# EasyEDA Pro project USB_C_BREADBOARD_PD.eprj, schematic Schematic2
Board Name: V2; Create Date: 2025-01-20; Page Name: P1; Project Name: USB_C_BREADBOARD_PD; Schematic Name: Schematic2; Update Date: 2025-02-18; Company: EasyEDA.com; Page Size: A4; Version: V1.0
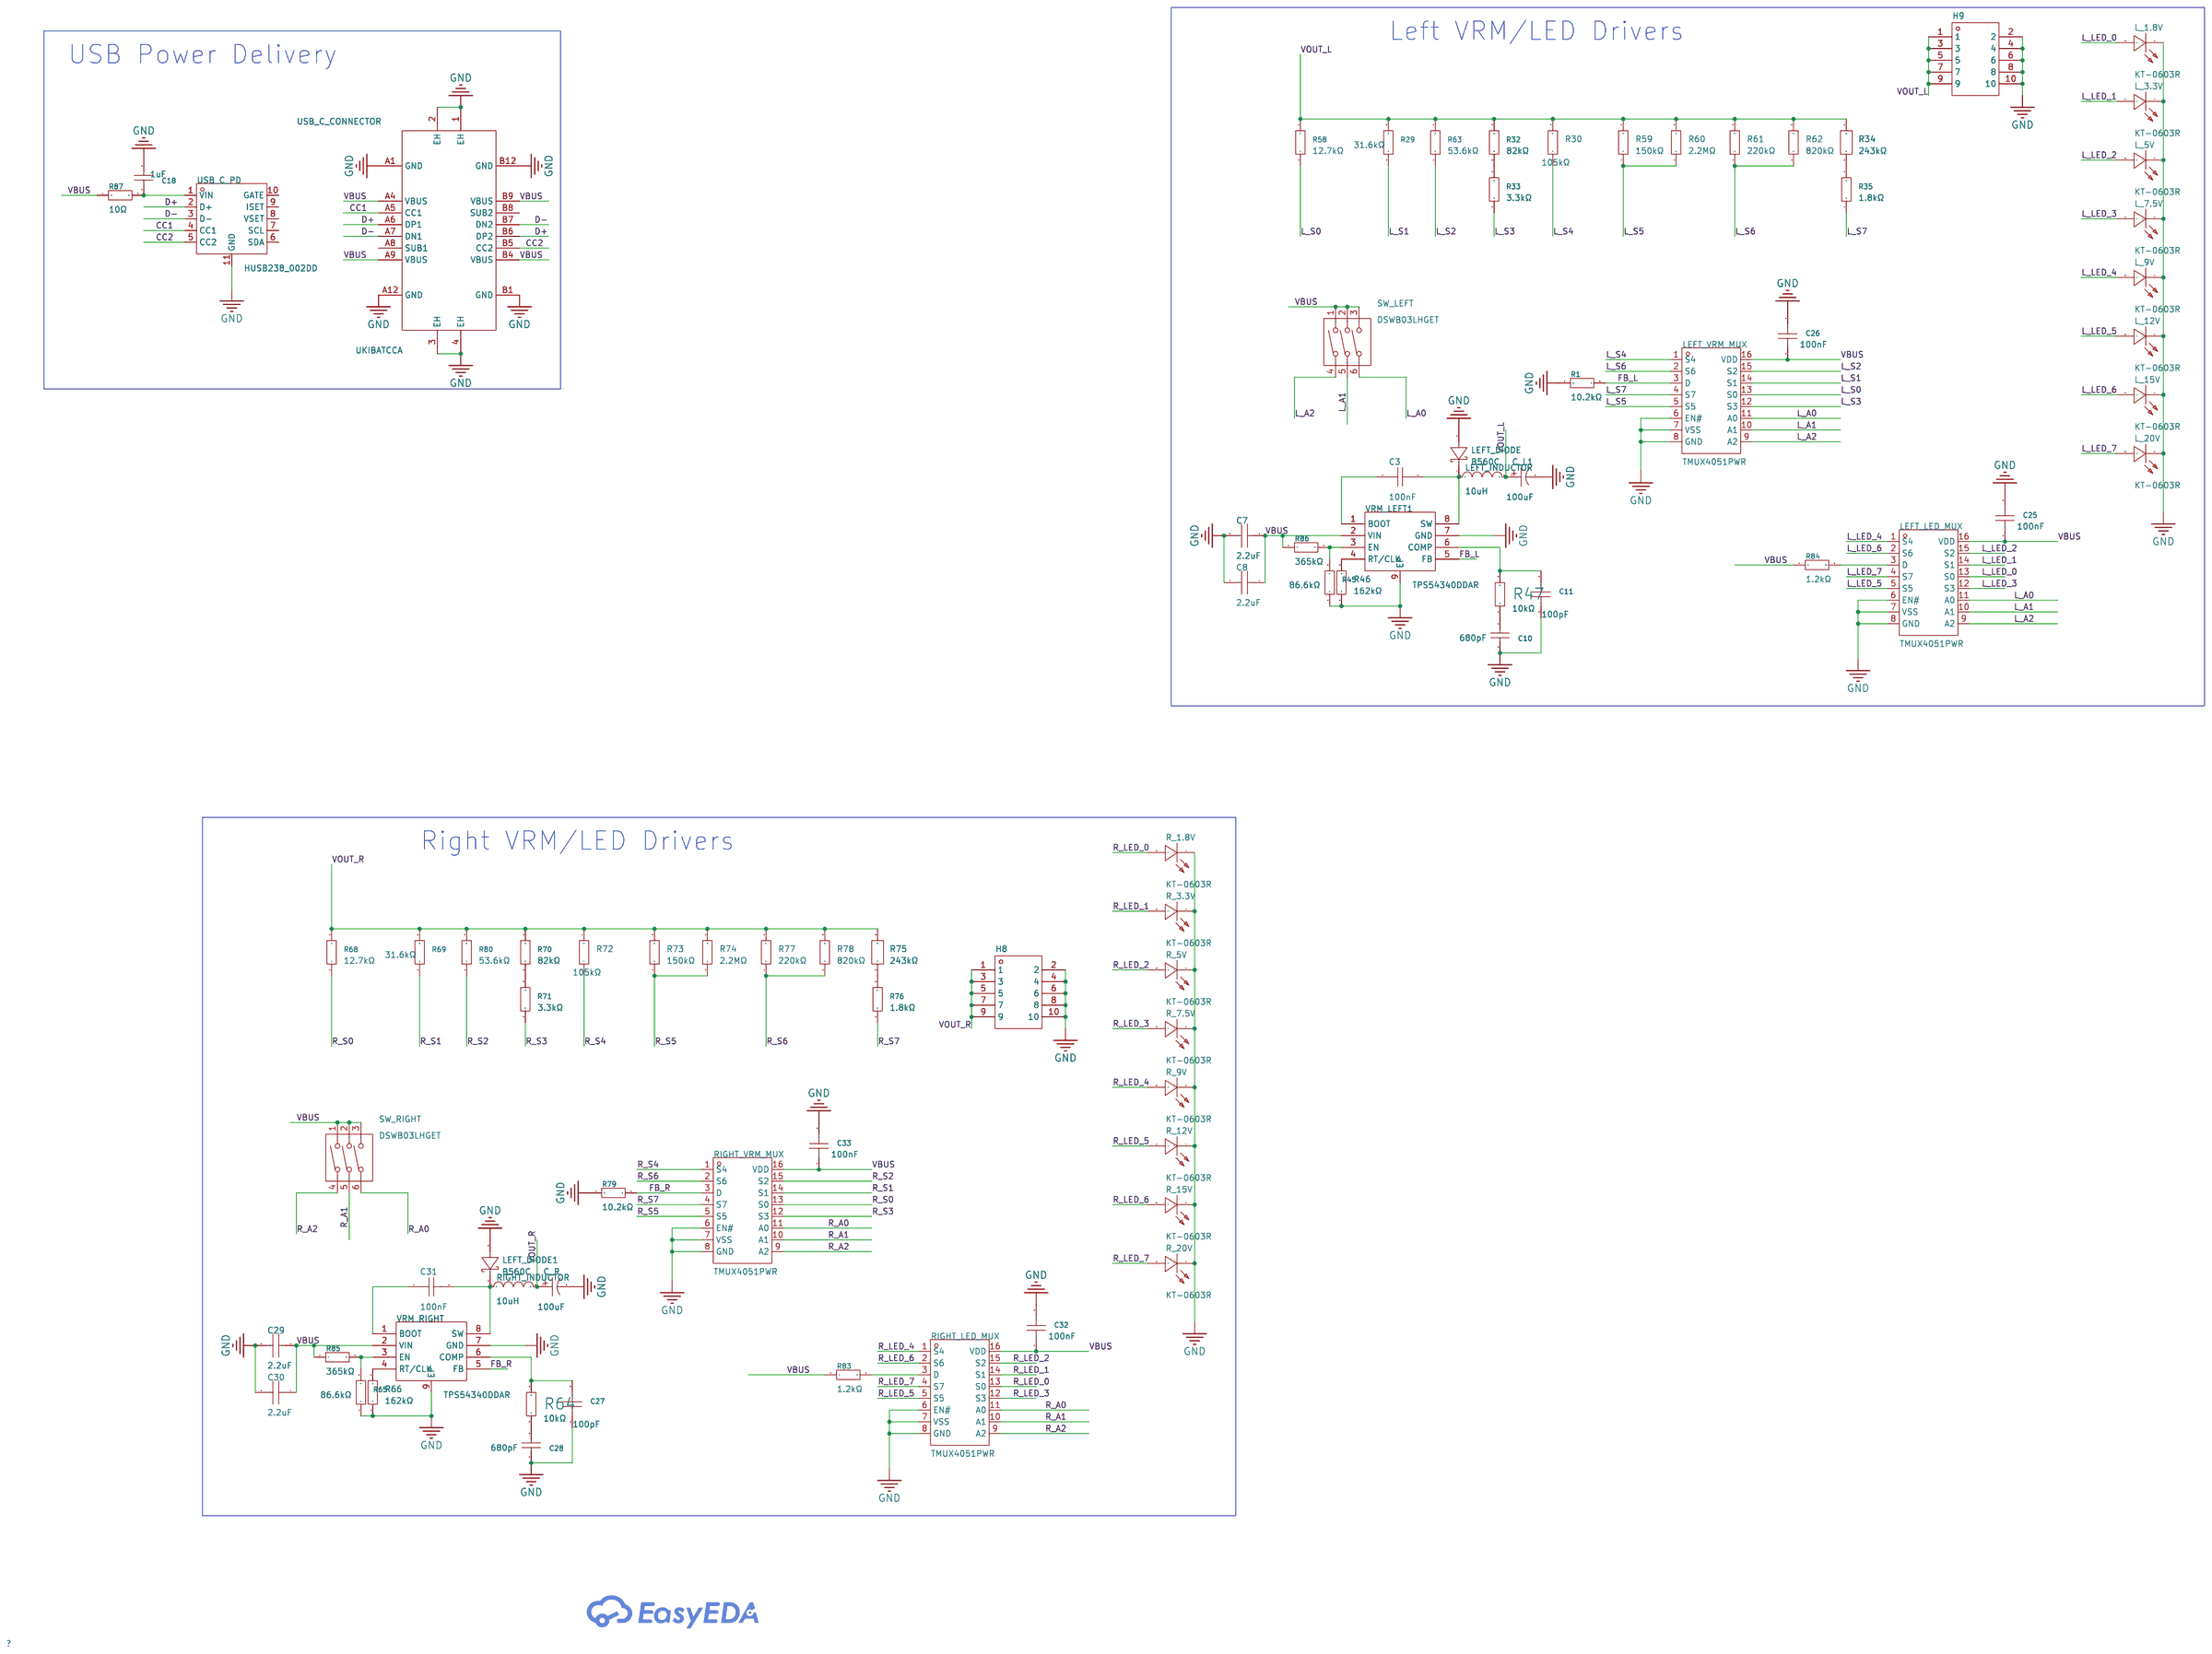
[diagram p1: schematic sheet]

## Parts
C3  100nF  [C0603]
C7  2.2uF  [C0402]
C8  2.2uF  [C0402]
C10  680pF  [C0603]
C11  100pF  [C0603]
C18  1uF  [C0402]
C25  100nF  [C0603]
C26  100nF  [C0603]
C27  100pF  [C0603]
C28  680pF  [C0603]
C29  2.2uF  [C0402]
C30  2.2uF  [C0402]
C31  100nF  [C0603]
C32  100nF  [C0603]
C33  100nF  [C0603]
C_L1  100uF  [CAP-SMD_BD6.3-L6.6-W6.6-LS7.6-FD]
C_R  100uF  [CAP-SMD_BD6.3-L6.6-W6.6-LS7.6-FD]
H8  -  [HDR-TH_10P-P2.54-V-M-R2-C5-S2.54]
H9  -  [HDR-TH_10P-P2.54-V-M-R2-C5-S2.54]
L_1.8V  KT-0603R  [LED0603-RD]
L_3.3V  KT-0603R  [LED0603-RD]
L_5V  KT-0603R  [LED0603-RD]
L_7.5V  KT-0603R  [LED0603-RD]
L_9V  KT-0603R  [LED0603-RD]
L_12V  KT-0603R  [LED0603-RD]
L_15V  KT-0603R  [LED0603-RD]
L_20V  KT-0603R  [LED0603-RD]
LEFT_DIODE  B560C  [SMC_L6.9-W5.9-LS7.9-RD]
LEFT_DIODE1  B560C  [SMC_L6.9-W5.9-LS7.9-RD]
LEFT_INDUCTOR  10uH  [IND-SMD_L7.3-W6.8]
LEFT_LED_MUX  TMUX4051PWR  [TSSOP-16_L5.0-W4.4-P0.65-LS6.4-BL]
LEFT_VRM_MUX  TMUX4051PWR  [TSSOP-16_L5.0-W4.4-P0.65-LS6.4-BL]
R1  10.2kΩ  [R0402]
R29  31.6kΩ  [R0603]
R30  105kΩ  [R0603]
R32  82kΩ  [R0603]
R33  3.3kΩ  [R0603]
R34  243kΩ  [R0603]
R35  1.8kΩ  [R0603]
R45  86.6kΩ  [R0603]
R46  162kΩ  [R0603]
R47  10kΩ  [R0603]
R58  12.7kΩ  [R0402]
R59  150kΩ  [R0402]
R60  2.2MΩ  [R0402]
R61  220kΩ  [R0402]
R62  820kΩ  [R0402]
R63  53.6kΩ  [R0402]
R64  10kΩ  [R0603]
R65  86.6kΩ  [R0603]
R66  162kΩ  [R0603]
R68  12.7kΩ  [R0402]
R69  31.6kΩ  [R0603]
R70  82kΩ  [R0603]
R71  3.3kΩ  [R0603]
R72  105kΩ  [R0603]
R73  150kΩ  [R0402]
R74  2.2MΩ  [R0402]
R75  243kΩ  [R0603]
R76  1.8kΩ  [R0603]
R77  220kΩ  [R0402]
R78  820kΩ  [R0402]
R79  10.2kΩ  [R0402]
R80  53.6kΩ  [R0402]
R83  1.2kΩ  [R0805]
R84  1.2kΩ  [R0805]
R85  365kΩ  [R0402]
R86  365kΩ  [R0402]
R87  10Ω  [R0603]
R_1.8V  KT-0603R  [LED0603-RD]
R_3.3V  KT-0603R  [LED0603-RD]
R_5V  KT-0603R  [LED0603-RD]
R_7.5V  KT-0603R  [LED0603-RD]
R_9V  KT-0603R  [LED0603-RD]
R_12V  KT-0603R  [LED0603-RD]
R_15V  KT-0603R  [LED0603-RD]
R_20V  KT-0603R  [LED0603-RD]
RIGHT_INDUCTOR  10uH  [IND-SMD_L7.3-W6.8]
RIGHT_LED_MUX  TMUX4051PWR  [TSSOP-16_L5.0-W4.4-P0.65-LS6.4-BL]
RIGHT_VRM_MUX  TMUX4051PWR  [TSSOP-16_L5.0-W4.4-P0.65-LS6.4-BL]
SW_LEFT  DSWB03LHGET  [SW-TH_DSWB03LHGET]
SW_RIGHT  DSWB03LHGET  [SW-TH_DSWB03LHGET]
USB_C_CONNECTOR  UKIBATCCA  [USB-C-SMD_UKIBATCCA]
USB_C_PD  HUSB238_002DD  [DFN-10_L3.0-W3.0-P0.50-BL-EP2.5]
VRM_LEFT1  TPS54340DDAR  [SOIC-8_L4.9-W3.9-P1.27-LS6.0-BL-EP3.3]
VRM_RIGHT  TPS54340DDAR  [SOIC-8_L4.9-W3.9-P1.27-LS6.0-BL-EP3.3]

## Library data of the parts
C3 C31 = CGA0603X7R104K500JT: LCSC Part Name: 100nF ±10% 50V; Supplier Part: C6119867; Manufacturer: HRE(芯声); Supplier Footprint: 0603; JLCPCB Part Class: Extended Part; Supplier: LCSC; Tolerance: ±10%; Voltage Rated: 50V
C7 C8 C29 C30 = CL05A225MQ5NSNC: LCSC Part Name: 2.2uF ±20% 6.3V; Supplier Part: C12530; Manufacturer: SAMSUNG(三星); Supplier Footprint: 0402; JLCPCB Part Class: Basic Part; Datasheet: https://atta.szlcsc.com/upload/public/pdf/source/20160218/1457707763339.pdf; Supplier: LCSC; Tolerance: ±20%
C10 C28 = CC0603JRNPO9BN681: LCSC Part Name: 680pF ±5% 50V; Supplier Part: C107055; Manufacturer: YAGEO(国巨); Supplier Footprint: 0603; JLCPCB Part Class: Extended Part; Datasheet: https://atta.szlcsc.com/upload/public/pdf/source/20170914/C128857_1505359892143968080.pdf; Supplier: LCSC; Tolerance: ±5%
C11 C27 = CC0603JRNPO9BN101: LCSC Part Name: 100pF ±5% 50V; Supplier Part: C14665; Manufacturer: YAGEO(国巨); Supplier Footprint: 0603; JLCPCB Part Class: Extended Part; Datasheet: https://atta.szlcsc.com/upload/public/pdf/source/20181008/C309499_21CC21451B82C39E3D92150FD6B30293.pdf; Supplier: LCSC; Tolerance: ±5%
C18 = CL05A105KO5NNNC: LCSC Part Name: 1uF ±10% 16V; Supplier Part: C29266; Manufacturer: SAMSUNG(三星); Supplier Footprint: 0402; JLCPCB Part Class: Extended Part; Datasheet: https://atta.szlcsc.com/upload/public/pdf/source/20160218/1457707763339.pdf; Supplier: LCSC; Tolerance: ±10%
C25 C26 C32 C33 = CC0603KRX7R9BB104: LCSC Part Name: 100nF ±10% 50V; Supplier Part: C14663; Manufacturer: YAGEO(国巨); Supplier Footprint: 0603; JLCPCB Part Class: Basic Part; Datasheet: https://atta.szlcsc.com/upload/public/pdf/source/20180910/C282072_33301C7F631E79921B82A8DAC6BCC5B3.pdf; Supplier: LCSC; Tolerance: ±10%
C_L1 C_R = RVT1V101M0607_C72478: LCSC Part Name: 100uF ±20% 35V; Supplier Part: C72478; Manufacturer: ROQANG(容强); Manufacturer Part: RVT1V101M0607; Supplier Footprint: SMD,D6.3xL7.7mm; JLCPCB Part Class: Extended Part; Datasheet: https://atta.szlcsc.com/upload/public/pdf/source/20170325/1490427950282.pdf; Supplier: LCSC; Tolerance: ±20%; Ripple Current: 69mA@120Hz; Lifetime @ Temp: 2000hrs@105℃; Operating Temperature: -40℃~+105℃
H8 H9 = HDR-M_2.54_2x5: Supplier Footprint: Through
L_1.8V L_3.3V L_5V L_7.5V L_9V L_12V L_15V L_20V R_1.8V R_3.3V R_5V R_7.5V R_9V R_12V R_15V R_20V = KT-0603R: LCSC Part Name: 0603 红灯 高亮; Supplier Part: C2286; Manufacturer: KENTO; Supplier Footprint: 0603; JLCPCB Part Class: Basic Part; Datasheet: https://atta.szlcsc.com/upload/public/pdf/source/20160616/1466072038404.pdf; Supplier: LCSC; Emitted Color: Red; Operating Temperature: -40℃~+85℃
LEFT_DIODE LEFT_DIODE1 = B560C_C6807784: LCSC Part Name: 电压:60V 电流:5A; Supplier Part: C6807784; Manufacturer: FUXINSEMI(富芯森美); Supplier Footprint: SMC(DO-214AB); JLCPCB Part Class: Extended Part; Datasheet: https://atta.szlcsc.com/upload/public/pdf/source/20230727/BBD047E09E3983A1DBEAE079A1E2DA84.pdf; Supplier: LCSC; Diode Configuration: Independent Type; Forward Voltage (Vf@If): 700mV@5A; Reverse Voltage (Vr): 60V; Rectified Current: 5A; Reverse Leakage Current (Ir): 100uA@60V
LEFT_INDUCTOR RIGHT_INDUCTOR = FXL0630-100-M: LCSC Part Name: 10uH ±20% 5.5A; Supplier Part: C167223; Manufacturer: cjiang(长江微电); Supplier Footprint: SMD,6.6x7mm; JLCPCB Part Class: Extended Part; Datasheet: https://atta.szlcsc.com/upload/public/pdf/source/20240426/3189EA8206330E2108542F9E34E540E7.pdf; Supplier: LCSC; Tolerance: ±20%; Saturation Current (Isat): 5.5A; Type: Integrated molded inductor
LEFT_LED_MUX LEFT_VRM_MUX RIGHT_LED_MUX RIGHT_VRM_MUX = TMUX4051PWR: LCSC Part Name: TMUX405x 24-V, 8:1, 1-Channel, 4:1, 2-Channel 和 2:1, 3-Channel 多路复用器，具有 1.8-V 逻辑; Supplier Part: C5449352; Manufacturer: TI(德州仪器); Supplier Footprint: TSSOP-16; JLCPCB Part Class: Extended Part; Datasheet: https://atta.szlcsc.com/upload/public/pdf/source/20230606/131CF238F6FC5714735FABCFDC2F1085.pdf; Supplier: LCSC; Switch Circuit: SP8T single pole eight throw; Number of Channels: 1; Supply Voltage: 5V~24V; Turn-on time: 85ns; On-State Resistance (Max): 40Ω
R1 R79 = 0402WGF1022TCE: LCSC Part Name: 10.2kΩ ±1% 62.5mW 厚膜电阻; Supplier Part: C11660; Manufacturer: UNI-ROYAL(厚声); Supplier Footprint: 0402; JLCPCB Part Class: Extended Part; Datasheet: https://atta.szlcsc.com/upload/public/pdf/source/20200306/C422600_1E6D84923E4A46A82E41ADD87F860B5C.pdf; Supplier: LCSC; Type: Thick Film Resistors; Tolerance: ±1%; Temperature Coefficient: ±100ppm/℃; Operating Temperature Range: -55℃~+155℃
R29 R69 = 0603WAF3162T5E: LCSC Part Name: 31.6kΩ ±1% 100mW 厚膜电阻; Supplier Part: C25967; Manufacturer: UNI-ROYAL(厚声); Supplier Footprint: 0603; JLCPCB Part Class: Extended Part; Datasheet: https://atta.szlcsc.com/upload/public/pdf/source/20200306/C422600_1E6D84923E4A46A82E41ADD87F860B5C.pdf; Supplier: LCSC; Type: Thick Film Resistors; Tolerance: ±1%; Temperature Coefficient: ±100ppm/℃; Operating Temperature Range: -55℃~+155℃
R30 R72 = 0603WAF1053T5E: LCSC Part Name: 105kΩ ±1% 100mW 厚膜电阻; Supplier Part: C16840; Manufacturer: UNI-ROYAL(厚声); Supplier Footprint: 0603; JLCPCB Part Class: Extended Part; Datasheet: https://atta.szlcsc.com/upload/public/pdf/source/20200306/C422600_1E6D84923E4A46A82E41ADD87F860B5C.pdf; Supplier: LCSC; Type: Thick Film Resistors; Tolerance: ±1%; Temperature Coefficient: ±100ppm/℃; Operating Temperature Range: -55℃~+155℃
R32 R70 = 0603WAF8202T5E: LCSC Part Name: 82kΩ ±1% 100mW 厚膜电阻; Supplier Part: C23254; Manufacturer: UNI-ROYAL(厚声); Supplier Footprint: 0603; JLCPCB Part Class: Basic Part; Datasheet: https://atta.szlcsc.com/upload/public/pdf/source/20200306/C422600_1E6D84923E4A46A82E41ADD87F860B5C.pdf; Supplier: LCSC; Type: Thick Film Resistors; Tolerance: ±1%; Temperature Coefficient: ±100ppm/℃; Operating Temperature Range: -55℃~+155℃
R33 R71 = 0603WAF3301T5E: LCSC Part Name: 3.3kΩ ±1% 100mW 厚膜电阻; Supplier Part: C22978; Manufacturer: UNI-ROYAL(厚声); Supplier Footprint: 0603; JLCPCB Part Class: Basic Part; Datasheet: https://atta.szlcsc.com/upload/public/pdf/source/20200306/C422600_1E6D84923E4A46A82E41ADD87F860B5C.pdf; Supplier: LCSC; Type: Thick Film Resistors; Tolerance: ±1%; Temperature Coefficient: ±100ppm/℃; Operating Temperature Range: -55℃~+155℃
R34 R75 = FRC0603F2433TS: LCSC Part Name: 厚膜电阻 243kΩ ±1% 100mW; Supplier Part: C7467321; Manufacturer: FOJAN(富捷); Supplier Footprint: 0603; JLCPCB Part Class: Extended Part; Datasheet: https://atta.szlcsc.com/upload/public/pdf/source/20211221/9022FBEBBD509006A57EBC43C1F2F40C.pdf; Supplier: LCSC; Type: Thick Film Resistors; Tolerance: ±1%; Temperature Coefficient: ±100ppm/℃
R35 R76 = 0603WAF1801T5E: LCSC Part Name: 1.8kΩ ±1% 100mW 厚膜电阻; Supplier Part: C4177; Manufacturer: UNI-ROYAL(厚声); Supplier Footprint: 0603; JLCPCB Part Class: Basic Part; Datasheet: https://atta.szlcsc.com/upload/public/pdf/source/20200306/C422600_1E6D84923E4A46A82E41ADD87F860B5C.pdf; Supplier: LCSC; Type: Thick Film Resistors; Tolerance: ±1%; Temperature Coefficient: ±100ppm/℃; Operating Temperature Range: -55℃~+155℃
R45 R65 = 0603WAF8662T5E: LCSC Part Name: 86.6kΩ ±1% 100mW 厚膜电阻; Supplier Part: C23121; Manufacturer: UNI-ROYAL(厚声); Supplier Footprint: 0603; JLCPCB Part Class: Extended Part; Datasheet: https://atta.szlcsc.com/upload/public/pdf/source/20200306/C422600_1E6D84923E4A46A82E41ADD87F860B5C.pdf; Supplier: LCSC; Type: Thick Film Resistors; Tolerance: ±1%; Temperature Coefficient: ±100ppm/℃; Operating Temperature Range: -55℃~+155℃
R46 R66 = 0603WAF1623T5E: LCSC Part Name: 162kΩ ±1% 100mW 厚膜电阻; Supplier Part: C22815; Manufacturer: UNI-ROYAL(厚声); Supplier Footprint: 0603; JLCPCB Part Class: Extended Part; Datasheet: https://atta.szlcsc.com/upload/public/pdf/source/20200306/C422600_1E6D84923E4A46A82E41ADD87F860B5C.pdf; Supplier: LCSC; Type: Thick Film Resistors; Tolerance: ±1%; Temperature Coefficient: ±100ppm/℃; Operating Temperature Range: -55℃~+155℃
R47 R64 = 0603WAF1002T5E: LCSC Part Name: 厚膜电阻 10kΩ ±1% 100mW; Supplier Part: C25804; Manufacturer: UNI-ROYAL(厚声); Supplier Footprint: 0603; JLCPCB Part Class: Basic Part; Datasheet: https://atta.szlcsc.com/upload/public/pdf/source/20200306/C422600_1E6D84923E4A46A82E41ADD87F860B5C.pdf; Supplier: LCSC; Type: Thick Film Resistors; Tolerance: ±1%; Temperature Coefficient: ±100ppm/℃; Operating Temperature Range: -55℃~+155℃
R58 R68 = 0402WGF1272TCE: LCSC Part Name: 12.7kΩ ±1% 62.5mW 厚膜电阻; Supplier Part: C25853; Manufacturer: UNI-ROYAL(厚声); Supplier Footprint: 0402; JLCPCB Part Class: Extended Part; Datasheet: https://atta.szlcsc.com/upload/public/pdf/source/20200306/C422600_1E6D84923E4A46A82E41ADD87F860B5C.pdf; Supplier: LCSC; Type: Thick Film Resistors; Tolerance: ±1%; Temperature Coefficient: ±100ppm/℃; Operating Temperature Range: -55℃~+155℃
R59 R73 = 0402WGF1503TCE: LCSC Part Name: 150kΩ ±1% 62.5mW 厚膜电阻; Supplier Part: C25755; Manufacturer: UNI-ROYAL(厚声); Supplier Footprint: 0402; JLCPCB Part Class: Extended Part; Datasheet: https://atta.szlcsc.com/upload/public/pdf/source/20200306/C422600_1E6D84923E4A46A82E41ADD87F860B5C.pdf; Supplier: LCSC; Type: Thick Film Resistors; Tolerance: ±1%; Temperature Coefficient: ±100ppm/℃; Operating Temperature Range: -55℃~+155℃
R60 R74 = RC0402JR-072M2L: LCSC Part Name: 厚膜电阻 2.2MΩ ±5% 62.5mW; Supplier Part: C274901; Manufacturer: YAGEO(国巨); Supplier Footprint: 0402; JLCPCB Part Class: Extended Part; Datasheet: https://atta.szlcsc.com/upload/public/pdf/source/20180821/C275644_0D56F95EFF785E7D9A1FEF436B37DA78.pdf; Supplier: LCSC; Type: Thick Film Resistors; Tolerance: ±5%; Temperature Coefficient: ±100ppm/℃; Operating Temperature Range: -55℃~+155℃
R61 R77 = 0402WGF2203TCE: LCSC Part Name: 220kΩ ±1% 62.5mW 厚膜电阻; Supplier Part: C25767; Manufacturer: UNI-ROYAL(厚声); Supplier Footprint: 0402; JLCPCB Part Class: Extended Part; Datasheet: https://atta.szlcsc.com/upload/public/pdf/source/20200306/C422600_1E6D84923E4A46A82E41ADD87F860B5C.pdf; Supplier: LCSC; Type: Thick Film Resistors; Tolerance: ±1%; Temperature Coefficient: ±100ppm/℃; Operating Temperature Range: -55℃~+155℃
R62 R78 = 0402WGF8203TCE: LCSC Part Name: 820kΩ ±1% 62.5mW 厚膜电阻; Supplier Part: C67558; Manufacturer: UNI-ROYAL(厚声); Supplier Footprint: 0402; JLCPCB Part Class: Extended Part; Datasheet: https://atta.szlcsc.com/upload/public/pdf/source/20200306/C422600_1E6D84923E4A46A82E41ADD87F860B5C.pdf; Supplier: LCSC; Type: Thick Film Resistors; Tolerance: ±1%; Temperature Coefficient: ±100ppm/℃; Operating Temperature: -55℃~+155℃
R63 R80 = 0402WGF5362TCE: LCSC Part Name: 53.6kΩ ±1% 62.5mW 厚膜电阻; Supplier Part: C53398; Manufacturer: UNI-ROYAL(厚声); Supplier Footprint: 0402; JLCPCB Part Class: Extended Part; Datasheet: https://atta.szlcsc.com/upload/public/pdf/source/20200306/C422600_1E6D84923E4A46A82E41ADD87F860B5C.pdf; Supplier: LCSC; Type: Thick Film Resistors; Tolerance: ±1%; Temperature Coefficient: ±100ppm/℃; Operating Temperature Range: -55℃~+155℃
R83 R84 = 0805W8F1201T5E: LCSC Part Name: 1.2kΩ ±1% 125mW 厚膜电阻; Supplier Part: C17379; Manufacturer: UNI-ROYAL(厚声); Supplier Footprint: 0805; JLCPCB Part Class: Basic Part; Datasheet: https://atta.szlcsc.com/upload/public/pdf/source/20200306/C422600_1E6D84923E4A46A82E41ADD87F860B5C.pdf; Supplier: LCSC; Type: Thick Film Resistors; Tolerance: ±1%; Temperature Coefficient: ±100ppm/℃; Operating Temperature Range: -55℃~+155℃
R85 R86 = 0402WGF3653TCE: LCSC Part Name: 365kΩ ±1% 62.5mW 厚膜电阻; Supplier Part: C27006; Manufacturer: UNI-ROYAL(厚声); Supplier Footprint: 0402; JLCPCB Part Class: Extended Part; Datasheet: https://atta.szlcsc.com/upload/public/pdf/source/20200306/C422600_1E6D84923E4A46A82E41ADD87F860B5C.pdf; Supplier: LCSC; Type: Thick Film Resistors; Tolerance: ±1%; Temperature Coefficient: ±100ppm/℃; Operating Temperature Range: -55℃~+155℃
R87 = 0603WAF100JT5E: LCSC Part Name: 10Ω ±1% 100mW 厚膜电阻; Supplier Part: C22859; Manufacturer: UNI-ROYAL(厚声); Supplier Footprint: 0603; JLCPCB Part Class: Basic Part; Datasheet: https://atta.szlcsc.com/upload/public/pdf/source/20200306/C422600_1E6D84923E4A46A82E41ADD87F860B5C.pdf; Supplier: LCSC; Type: Thick Film Resistors; Tolerance: ±1%; Temperature Coefficient: ±400ppm/℃; Operating Temperature Range: -55℃~+155℃
SW_LEFT SW_RIGHT = DSWB03LHGET: LCSC Part Name: 间距2.54mm 平拨,凸起式 3位拨码开关; Supplier Part: C99420; Manufacturer: YE; Supplier Footprint: 插件; JLCPCB Part Class: Extended Part; Datasheet: https://atta.szlcsc.com/upload/public/pdf/source/20170330/1490854274194.pdf; Supplier: LCSC; Type: 平拨,凸起式; Circuit: SPST; Number of Positions: 3Bit; Lead Pitch: 2.54mm; Color: Red
USB_C_CONNECTOR = UKIBATCCA: LCSC Part Name: Type-C 母 卧贴; Supplier Part: C29780877; Manufacturer: SAMZO(三佐); Supplier Footprint: SMD; JLCPCB Part Class: Extended Part; Datasheet: https://atta.szlcsc.com/upload/public/pdf/source/20240717/32BE29DCF56E1C8211E6A8D6AE117405.pdf; Supplier: LCSC; Connector Type: Type-C; Gender: Female; Mounting Style: Horizontal attachment; Number of Contacts: 16P; Number of Ports: 1; Current Rating - Power (Max): 5A; Rated Voltage (Max): 20V; Connect-Disconnect Life: 10,000 times; Length: 6.5mm; Core Colour: Black; Operating Temperature Range: -25℃~+85℃
USB_C_PD = HUSB238_002DD: Supplier Part: C7471904; Manufacturer: Hynetek(慧能泰); Supplier Footprint: DFN-10L(3x3); JLCPCB Part Class: Extended Part; Datasheet: https://atta.szlcsc.com/upload/public/pdf/source/20240407/14E2BCB22C39B22B34E48E1B6FC2FE3E.pdf; Supplier: LCSC
VRM_LEFT1 VRM_RIGHT = TPS54340DDAR: LCSC Part Name: 42V输入3.5A降压DC-DC转换器; Supplier Part: C45886; Manufacturer: TI(德州仪器); Supplier Footprint: SOIC-8-EP; JLCPCB Part Class: Extended Part; Datasheet: https://www.ti.com/cn/lit/gpn/tps54340; Supplier: LCSC; Function: Step-down type; Output Type: Adjustable; Input Voltage: 4.5V~42V; Output Voltage: 800mV~41.1V; Output Current: 3.5A; Switching Frequency: 2.5MHz; Operating Temperature: -40℃~+150℃@(TJ); Synchronous Rectification: No; Number of Outputs: 1; Topology: Step-down; Switch tube (built-in/external): Built-in

## Nets
GND: C7.2 C8.2 C10.1 C11.1 C18.2 C25.2 C26.2 C27.1 C28.1 C29.2 C30.2 C32.2 C33.2 C_L1.2 C_R.2 H8.2 H8.4 H8.6 H8.8 H8.10 H9.2 H9.4 H9.6 H9.8 H9.10 L_1.8V.1(K) L_3.3V.1(K) L_5V.1(K) L_7.5V.1(K) L_9V.1(K) L_12V.1(K) L_15V.1(K) L_20V.1(K) LEFT_DIODE.2(A) LEFT_DIODE1.2(A) LEFT_LED_MUX.6(EN#) LEFT_LED_MUX.7(VSS) LEFT_LED_MUX.8(GND) LEFT_VRM_MUX.6(EN#) LEFT_VRM_MUX.7(VSS) LEFT_VRM_MUX.8(GND) R1.1 R45.1 R46.1 R65.1 R66.1 R79.1 R_1.8V.1(K) R_3.3V.1(K) R_5V.1(K) R_7.5V.1(K) R_9V.1(K) R_12V.1(K) R_15V.1(K) R_20V.1(K) RIGHT_LED_MUX.6(EN#) RIGHT_LED_MUX.7(VSS) RIGHT_LED_MUX.8(GND) RIGHT_VRM_MUX.6(EN#) RIGHT_VRM_MUX.7(VSS) RIGHT_VRM_MUX.8(GND) USB_C_CONNECTOR.1(EH) USB_C_CONNECTOR.2(EH) USB_C_CONNECTOR.3(EH) USB_C_CONNECTOR.4(EH) USB_C_CONNECTOR.A1(GND) USB_C_CONNECTOR.A12(GND) USB_C_CONNECTOR.B1(GND) USB_C_CONNECTOR.B12(GND) USB_C_PD.11(GND) VRM_LEFT1.7(GND) VRM_LEFT1.9(EP) VRM_RIGHT.7(GND) VRM_RIGHT.9(EP)
VBUS: C7.1 C8.1 C25.1 C26.1 C29.1 C30.1 C32.1 C33.1 LEFT_LED_MUX.16(VDD) LEFT_VRM_MUX.16(VDD) R83.1 R84.1 R85.1 R86.1 R87.1 RIGHT_LED_MUX.16(VDD) RIGHT_VRM_MUX.16(VDD) SW_LEFT.1 SW_LEFT.2 SW_LEFT.3 SW_RIGHT.1 SW_RIGHT.2 SW_RIGHT.3 USB_C_CONNECTOR.A4(VBUS) USB_C_CONNECTOR.A9(VBUS) USB_C_CONNECTOR.B4(VBUS) USB_C_CONNECTOR.B9(VBUS) VRM_LEFT1.2(VIN) VRM_RIGHT.2(VIN)
CC1: USB_C_CONNECTOR.A5(CC1) USB_C_PD.4(CC1)
CC2: USB_C_CONNECTOR.B5(CC2) USB_C_PD.5(CC2)
D+: USB_C_CONNECTOR.A6(DP1) USB_C_CONNECTOR.B6(DP2) USB_C_PD.2(D+)
D-: USB_C_CONNECTOR.A7(DN1) USB_C_CONNECTOR.B7(DN2) USB_C_PD.3(D-)
FB_L: LEFT_VRM_MUX.3(D) R1.2 VRM_LEFT1.5(FB)
FB_R: R79.2 RIGHT_VRM_MUX.3(D) VRM_RIGHT.5(FB)
L_A0: LEFT_LED_MUX.11(A0) LEFT_VRM_MUX.11(A0) SW_LEFT.6
L_A1: LEFT_LED_MUX.10(A1) LEFT_VRM_MUX.10(A1) SW_LEFT.5
L_A2: LEFT_LED_MUX.9(A2) LEFT_VRM_MUX.9(A2) SW_LEFT.4
L_LED_0: L_1.8V.2(A) LEFT_LED_MUX.13(S0)
L_LED_1: L_3.3V.2(A) LEFT_LED_MUX.14(S1)
L_LED_2: L_5V.2(A) LEFT_LED_MUX.15(S2)
L_LED_3: L_7.5V.2(A) LEFT_LED_MUX.12(S3)
L_LED_4: L_9V.2(A) LEFT_LED_MUX.1(S4)
L_LED_5: L_12V.2(A) LEFT_LED_MUX.5(S5)
L_LED_6: L_15V.2(A) LEFT_LED_MUX.2(S6)
L_LED_7: L_20V.2(A) LEFT_LED_MUX.4(S7)
L_S0: LEFT_VRM_MUX.13(S0) R58.1
L_S1: LEFT_VRM_MUX.14(S1) R29.1
L_S2: LEFT_VRM_MUX.15(S2) R63.1
L_S3: LEFT_VRM_MUX.12(S3) R33.1
L_S4: LEFT_VRM_MUX.1(S4) R30.1
L_S5: LEFT_VRM_MUX.5(S5) R59.1 R60.1
L_S6: LEFT_VRM_MUX.2(S6) R61.1 R62.1
L_S7: LEFT_VRM_MUX.4(S7) R35.1
R_A0: RIGHT_LED_MUX.11(A0) RIGHT_VRM_MUX.11(A0) SW_RIGHT.6
R_A1: RIGHT_LED_MUX.10(A1) RIGHT_VRM_MUX.10(A1) SW_RIGHT.5
R_A2: RIGHT_LED_MUX.9(A2) RIGHT_VRM_MUX.9(A2) SW_RIGHT.4
R_LED_0: R_1.8V.2(A) RIGHT_LED_MUX.13(S0)
R_LED_1: R_3.3V.2(A) RIGHT_LED_MUX.14(S1)
R_LED_2: R_5V.2(A) RIGHT_LED_MUX.15(S2)
R_LED_3: R_7.5V.2(A) RIGHT_LED_MUX.12(S3)
R_LED_4: R_9V.2(A) RIGHT_LED_MUX.1(S4)
R_LED_5: R_12V.2(A) RIGHT_LED_MUX.5(S5)
R_LED_6: R_15V.2(A) RIGHT_LED_MUX.2(S6)
R_LED_7: R_20V.2(A) RIGHT_LED_MUX.4(S7)
R_S0: R68.1 RIGHT_VRM_MUX.13(S0)
R_S1: R69.1 RIGHT_VRM_MUX.14(S1)
R_S2: R80.1 RIGHT_VRM_MUX.15(S2)
R_S3: R71.1 RIGHT_VRM_MUX.12(S3)
R_S4: R72.1 RIGHT_VRM_MUX.1(S4)
R_S5: R73.1 R74.1 RIGHT_VRM_MUX.5(S5)
R_S6: R77.1 R78.1 RIGHT_VRM_MUX.2(S6)
R_S7: R76.1 RIGHT_VRM_MUX.4(S7)
VOUT_L: C_L1.1 H9.1 H9.3 H9.5 H9.7 H9.9 LEFT_INDUCTOR.2 R29.2 R30.2 R32.2 R34.2 R58.2 R59.2 R60.2 R61.2 R62.2 R63.2
VOUT_R: C_R.1 H8.1 H8.3 H8.5 H8.7 H8.9 R68.2 R69.2 R70.2 R72.2 R73.2 R74.2 R75.2 R77.2 R78.2 R80.2 RIGHT_INDUCTOR.2
$1N2320: C3.1 VRM_LEFT1.1(BOOT)
$1N2321: C3.2 LEFT_DIODE.1(K) LEFT_INDUCTOR.1 VRM_LEFT1.8(SW)
$1N2348: R45.2 R86.2 VRM_LEFT1.3(EN)
$1N2349: R46.2 VRM_LEFT1.4(RT/CLK)
$1N2350: C11.2 R47.2 VRM_LEFT1.6(COMP)
$1N2351: C10.2 R47.1
$1N2372: C18.1 R87.2 USB_C_PD.1(VIN)
$1N8624: R32.1 R33.2
$1N9271: R34.1 R35.2
$1N10051: LEFT_LED_MUX.3(D) R84.2
$1N12210: C28.2 R64.1
$1N12211: C27.2 R64.2 VRM_RIGHT.6(COMP)
$1N12212: R66.2 VRM_RIGHT.4(RT/CLK)
$1N12213: R65.2 R85.2 VRM_RIGHT.3(EN)
$1N12220: C31.2 LEFT_DIODE1.1(K) RIGHT_INDUCTOR.1 VRM_RIGHT.8(SW)
$1N12221: C31.1 VRM_RIGHT.1(BOOT)
$1N12258: R70.1 R71.2
$1N12280: R75.1 R76.2
$1N12321: R83.2 RIGHT_LED_MUX.3(D)

Not connected (* = marked no-connect by the designer): USB_C_CONNECTOR A8(SUB1) B8(SUB2); USB_C_PD 6(SDA) 7(SCL) 8(VSET) 9(ISET) 10(GATE)

## Notes on the sheet
- Left VRM/LED Drivers
- USB Power Delivery
- Right VRM/LED Drivers
